# EAGLE design SiPM_Ada_S13360_v05_DualTip (EAGLE 7.7.0)
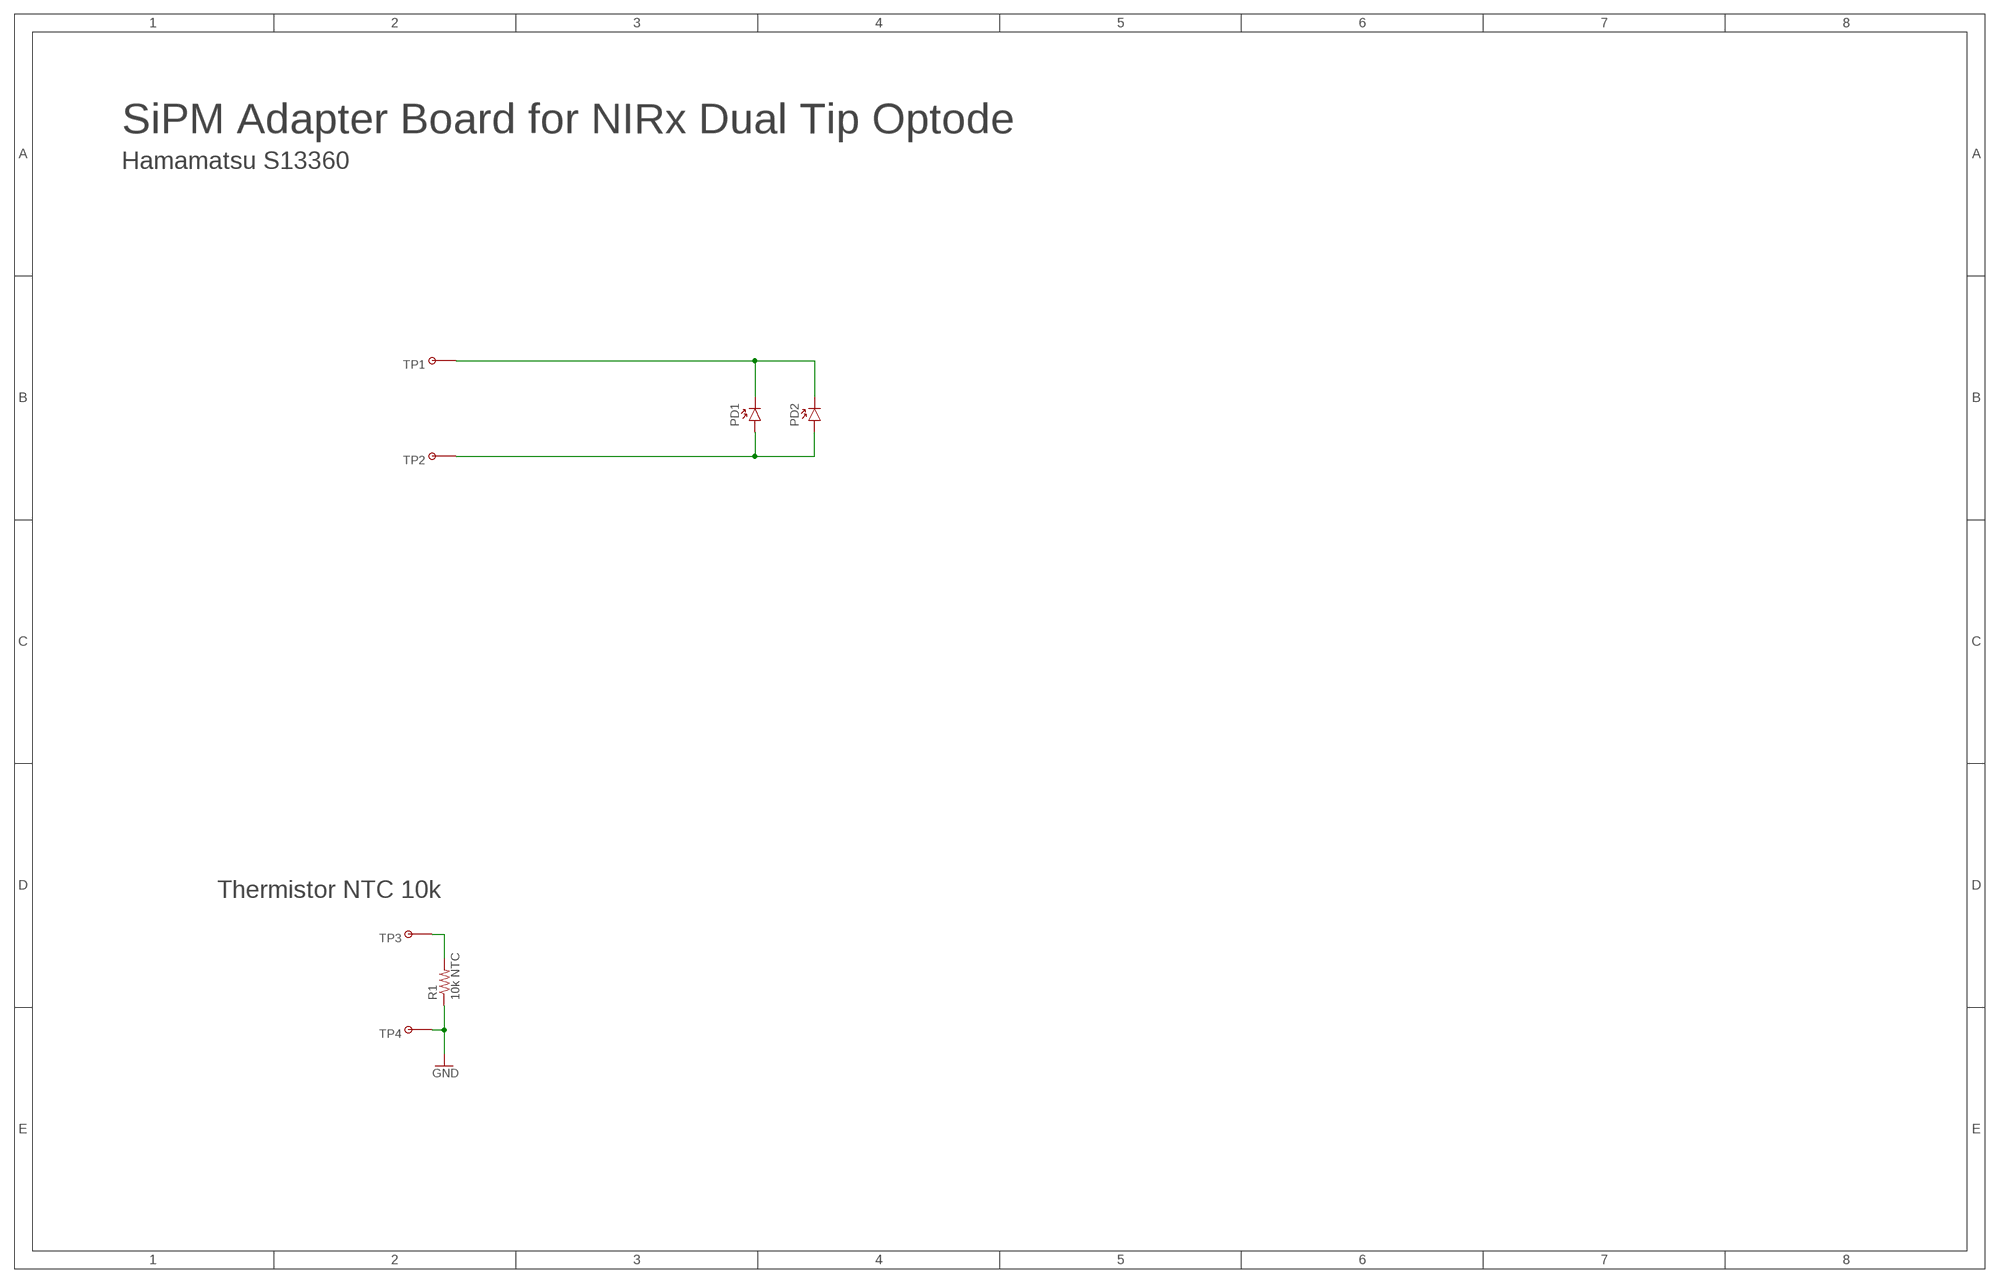
[diagram p0: schematic, sheet 1]

## Parts
PD1  PHOTODIODE_S13360-30XXPE  [S13360-30XXPE]
PD2  PHOTODIODE_S13360-30XXPE  [S13360-30XXPE]
R1  10k NTC  RESISTOR0603-RES  [0603-RES]
TP1  TESTPOINT_PADMEDIUM  [TESTPAD_MEDIUM]
TP2  TESTPOINT_PADMEDIUM  [TESTPAD_MEDIUM]
TP3  TESTPOINT_PADMEDIUM  [TESTPAD_MEDIUM]
TP4  TESTPOINT_PADMEDIUM  [TESTPAD_MEDIUM]

## Nets
A: PD1.A PD2.A TP2.P$1
C: PD1.C PD2.C TP1.P$1
GND: R1.1 TP4.P$1
T: R1.2 TP3.P$1

## Notes on the sheet
- SiPM Adapter Board for NIRx Dual Tip Optode
- Hamamatsu S13360
- Thermistor NTC 10k

## Library data of the parts
PD1 PD2 = MyLib:PHOTODIODE
R1 = MyLib:RESISTOR: Resistor Basic schematic elements and footprints for 0603, 1206, and PTH resistors.
TP1-TP4 = MyLib:TESTPOINT

## Board
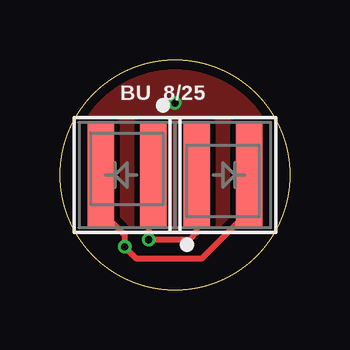
[diagram p1: board, top side]
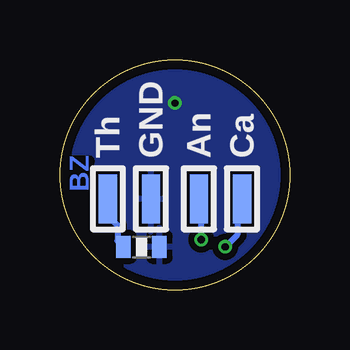
[diagram p2: board, bottom side, seen from below]

Size 9.6 x 9.6 mm. Coordinates in mm from the lower left corner, seen from the top.
Outline: circle at 4.8,4.8 radius 4.8
Copper layers (1*16): Top 0.035559375mm / dielectric 1.6mm / Bottom 0.035559375mm
Design rules "oshpark-2layer": minimum track width 6mil, minimum drill 10mil, track to track 6mil, track to pad 6mil, pad to pad 6mil, via to via 6mil, smd to smd 6mil, copper to edge 15mil, drill to drill 6mil, minimum pad ring 5mil, minimum via ring 5mil, stop-mask expansion 2.5mil, vias tented up to drill 12mil, thermal gap 10mil

### Footprints (pad centres in the part's own frame; a part is rotated, then mirrored left to right if it is on the bottom)
S13360-30XXPE = smd 4.35 x 1.1: A 0,1.1; C 0,-1.1
0603-RES = smd 0.6 x 0.9: 1 -0.75,0; 2 0.75,0
TESTPAD_MEDIUM = smd 2.032 x 0.762: P$1 0,0

### Placement (x,y rotation side)
PD1  2.8,4.8 270 top
PD2  6.8,4.8 90 top
R1  6.2,1.8 180 bottom
TP1  2,3.8 270 bottom
TP2  3.8,3.8 270 bottom
TP3  7.6,3.8 270 bottom
TP4  5.8,3.8 270 bottom

### Tracks (layer width: path | path; a pad name or v marks a point on that pad's centre or on a via)
A  (via drill 0.3)
  Top 0.254: PD1.A 3.9,3 3.7,2.8 v3.7,2.1 5.4,2.1 5.7,2.4 PD2.A
  Bottom 0.254: v3.7,2.1 3.7,3.7 TP2.P$1
C  (via drill 0.3)
  Top 0.254: PD2.C 7.9,3.3 5.9,1.3 3.2,1.3 v2.7,1.8 2.7,2.3 1.7,3.3 PD1.C
  Bottom 0.254: TP1.P$1 2,3.1 2.2,2.9 2.2,2.3 v2.7,1.8
GND  (via drill 0.3)
  other vias: 4.8,7.8
  pour Bottom (isolate 0.254, rank 3): -0.2,-0.2 9.8,-0.2 9.8,9.8 -0.2,9.8
  pour Top (isolate 0.254, rank 3): -0.2,-0.2 9.8,-0.2 9.8,9.8 -0.2,9.8
T
  Bottom 0.254: TP3.P$1 7.6,3.1 7.2,2.7 7.2,2.05 R1.2

### Text on the board
Bottom: BZ
tPlace: BU 8/25
bPlace: Ca | An | GND | Th